# Altium schematic sheet TD.0002-100_2.SchDoc: ДТТ-1
size 420 x 297 mm; ApprovedBy: Маханов; CheckedBy: Айкеева; Organization: РЭТ-41; SheetNumber: 2; SheetTotal: 3; ProcessInspection: Айкеева; NormInspection: Мухамедрахимова
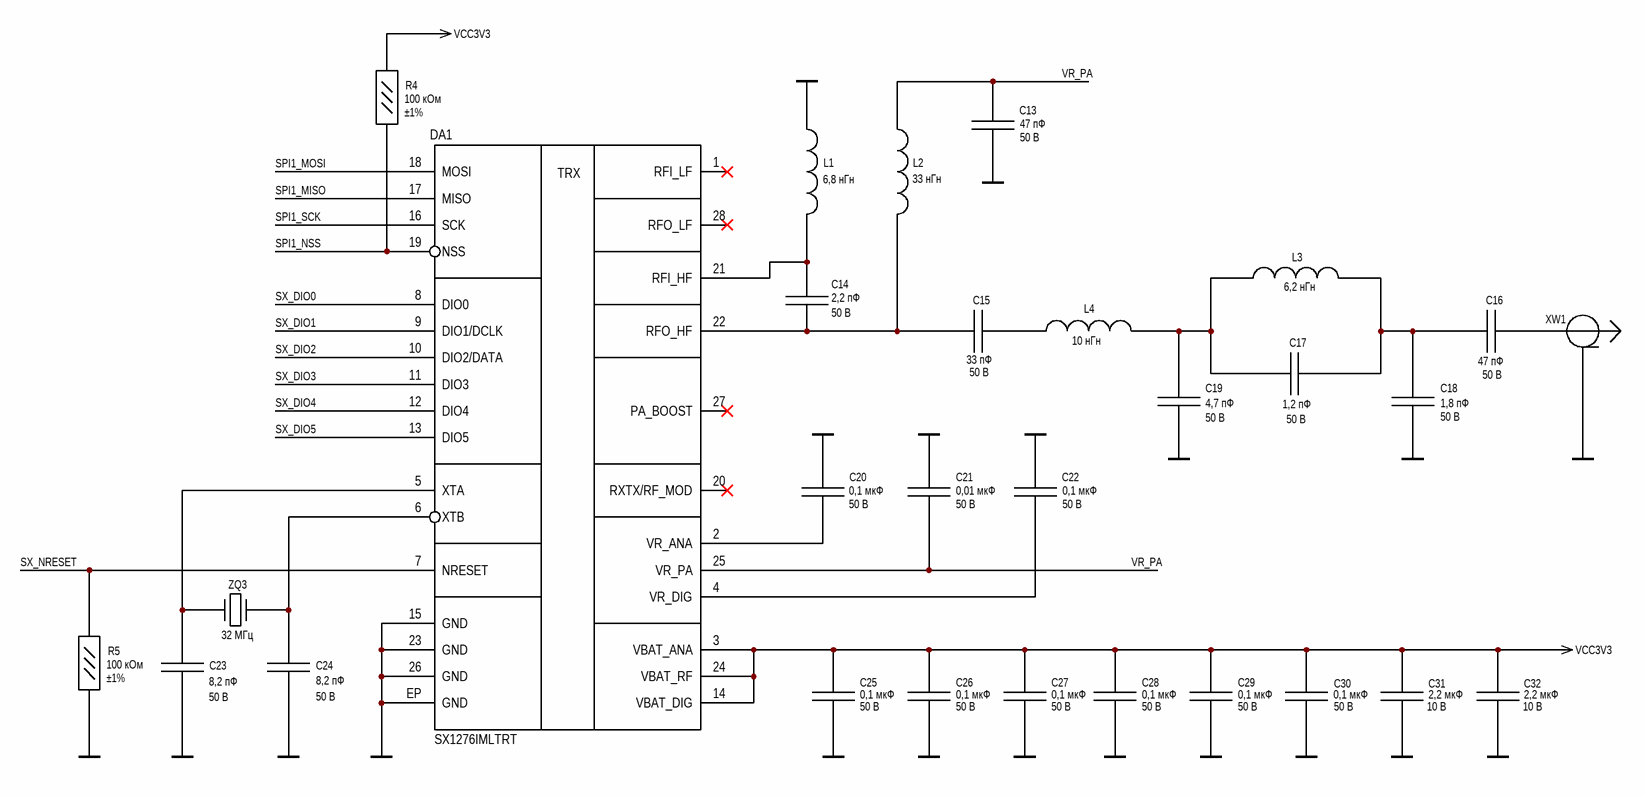
[diagram p0: TD.0002-100_2.SchDoc]

## Parts
C13  value 47 пФ  Voltage: 50 В  [C_0402]  (hidden comment: GRM1555C1H470GA01)
C14  value 2,2 пФ  Voltage: 50 В  [C_0402]  (hidden comment: GRM1555C1H2R2CA01)
C15  value 33 пФ  Voltage: 50 В  [C_0402]  (hidden comment: GRM1555C1H330GA01)
C16  value 47 пФ  Voltage: 50 В  [C_0402]  (hidden comment: GRM1555C1H470GA01)
C17  value 1,2 пФ  Voltage: 50 В  [C_0402]  (hidden comment: GRM1555C1H1R2CA01)
C18  value 1,8 пФ  Voltage: 50 В  [C_0402]  (hidden comment: GRM1555C1H1R8CA01)
C19  value 4,7 пФ  Voltage: 50 В  [C_0402]  (hidden comment: GRM1555C1H4R7CA01)
C20  value 0,1 мкФ  Voltage: 50 В  [C_0402]  (hidden comment: GRM155R71H104KE14)
C21  value 0,01 мкФ  Voltage: 50 В  [C_0402]  (hidden comment: GRM155R71H103KA88)
C22  value 0,1 мкФ  Voltage: 50 В  [C_0402]  (hidden comment: GRM155R71H104KE14)
C23  value 8,2 пФ  Voltage: 50 В  [C_0402]  (hidden comment: GRM1555C1H8R2WA01)
C24  value 8,2 пФ  Voltage: 50 В  [C_0402]  (hidden comment: GRM1555C1H8R2WA01)
C25  value 0,1 мкФ  Voltage: 50 В  [C_0402]  (hidden comment: GRM155R71H104KE14)
C26  value 0,1 мкФ  Voltage: 50 В  [C_0402]  (hidden comment: GRM155R71H104KE14)
C27  value 0,1 мкФ  Voltage: 50 В  [C_0402]  (hidden comment: GRM155R71H104KE14)
C28  value 0,1 мкФ  Voltage: 50 В  [C_0402]  (hidden comment: GRM155R71H104KE14)
C29  value 0,1 мкФ  Voltage: 50 В  [C_0402]  (hidden comment: GRM155R71H104KE14)
C30  value 0,1 мкФ  Voltage: 50 В  [C_0402]  (hidden comment: GRM155R71H104KE14)
C31  value 2,2 мкФ  Voltage: 10 В  [C_0402]  (hidden comment: GRM155C81A225ME44)
C32  value 2,2 мкФ  Voltage: 10 В  [C_0402]  (hidden comment: GRM155C81A225ME44)
DA1  SX1276IMLTRT  [QFN_28]
L1  value 6,8 нГн  [L_0402]  (hidden comment: LQW15AN6N8G80)
L2  value 33 нГн  [L_0402]  (hidden comment: LQW15AN33NJ00)
L3  value 6,2 нГн  [L_0402]  (hidden comment: LQW15AN6N2G8Z)
L4  value 10 нГн  [L_0402]  (hidden comment: LQW15AN10NG80)
R4  value 100 кОм  Accuracy: ±1%  [R_0402]  (hidden comment: RC0402FR-07100KL)
R5  value 100 кОм  Accuracy: ±1%  [R_0402]  (hidden comment: RC0402FR-07100KL)
XW1  U.FL-R-SMT  [U.FL-R-SMT]  (value not drawn)
ZQ3  value 32 МГц  [CM9V-T1A]  (hidden comment: Quartz)

## Nets
GND: C13.2 C18.2 C19.2 C20.1 C21.1 C22.1 C23.2 C24.2 C25.2 C26.2 C27.2 C28.2 C29.2 C30.2 C31.2 C32.2 DA1.15(GND) DA1.23(GND) DA1.26(GND) DA1.EP(GND) L1.1 R5.1 XW1.2(GND)
VCC3V3: C25.1 C26.1 C27.1 C28.1 C29.1 C30.1 C31.1 C32.1 DA1.3(VBAT_ANA) DA1.14(VBAT_DIG) DA1.24(VBAT_RF) R4.2
SPI1_MISO: DA1.17(MISO)
SPI1_MOSI: DA1.18(MOSI)
SPI1_NSS: DA1.19(NSS) R4.1
SPI1_SCK: DA1.16(SCK)
SX_DIO0: DA1.8(DIO0)
SX_DIO1: DA1.9(DIO1/DCLK)
SX_DIO2: DA1.10(DIO2/DATA)
SX_DIO3: DA1.11(DIO3)
SX_DIO4: DA1.12(DIO4)
SX_DIO5: DA1.13(DIO5)
SX_NRESET: DA1.7(NRESET) R5.2
VR_PA: C13.1 C21.2 DA1.25(VR_PA) L2.1
NetC14_1: C14.1 DA1.21(RFI_HF) L1.2
NetC14_2: C14.2 C15.1 DA1.22(RFO_HF) L2.2
NetC15_2: C15.2 L4.1
NetC16_1: C16.1 C17.2 C18.1 L3.2
NetC16_2: C16.2 XW1.1(SIGNAL)
NetC17_1: C17.1 C19.1 L3.1 L4.2
NetC20_2: C20.2 DA1.2(VR_ANA)
NetC22_2: C22.2 DA1.4(VR_DIG)
NetC23_1: C23.1 DA1.5(XTA) ZQ3.1(XI)
NetC24_1: C24.1 DA1.6(XTB) ZQ3.2(XO)

Not connected (* = marked no-connect by the designer): DA1 1(RFI_LF)* 20(RXTX/RF_MOD)* 27(PA_BOOST)* 28(RFO_LF)*

## Notes on the sheet
- Перв. примен.
- Справ. №
- Подп. и дата
- Инв. № дубл.
- Взам. инв. №
- Изм.
- Лист
- № докум.
- Подп.
- Дата
- Лит.
- Масса
- Масштаб
- Т.контр.
- Пров.
- Разраб.
- Листов
- Инв. № подл.
- Н.контр.
- Утв.
- Копировал
- Формат А3
- (in symbol SX1276IMLTRT) TRX

## Library data of the parts
C13 C16 = GRM1555C1H470GA01: Chip Multilayer Ceramic Capacitor; Manufacturer: Murata; TC: C0G; Tolerance: ±2%; Type: Конденсатор керамический; Operating temperature: -55 … 125 °C; Part Number: GRM1555C1H470GA01; Library Ref: *; Library Path: *; Package: SMD 0402; Temperature coefficient: *
C14 = GRM1555C1H2R2CA01: Chip Multilayer Ceramic Capacitor; Manufacturer: Murata; TC: C0G; Tolerance: ±0,25 пФ; Type: Конденсатор керамический; Operating temperature: -55 … 125 °C; Part Number: GRM1555C1H2R2CA01; Library Ref: *; Library Path: *; Package: SMD 0402; Temperature coefficient: *
C15 = GRM1555C1H330GA01: Chip Multilayer Ceramic Capacitor; Manufacturer: Murata; TC: C0G; Tolerance: ±2%; Type: Конденсатор керамический; Operating temperature: -55 … 125 °C; Part Number: GRM1555C1H330GA01; Library Ref: *; Library Path: *; Package: SMD 0402; Temperature coefficient: *
C17 = GRM1555C1H1R2CA01: Chip Multilayer Ceramic Capacitor; Manufacturer: Murata; TC: C0G; Tolerance: ±0,25 пФ; Type: Конденсатор керамический; Operating temperature: -55 … 125 °C; Part Number: GRM1555C1H1R2CA01; Library Ref: *; Library Path: *; Package: SMD 0402; Temperature coefficient: *
C18 = GRM1555C1H1R8CA01: Chip Multilayer Ceramic Capacitor; Manufacturer: Murata; TC: C0G; Tolerance: ±0,25 пФ; Type: Конденсатор керамический; Operating temperature: -55 … 125 °C; Part Number: GRM1555C1H1R8CA01; Library Ref: *; Library Path: *; Package: SMD 0402; Temperature coefficient: *
C19 = GRM1555C1H4R7CA01: Chip Multilayer Ceramic Capacitor; Manufacturer: Murata; TC: C0G; Tolerance: ±0,25 пФ; Type: Конденсатор керамический; Operating temperature: -55 … 125 °C; Part Number: GRM1555C1H4R7CA01; Library Ref: *; Library Path: *; Package: SMD 0402; Temperature coefficient: *
C20 C22 C25-C30 = GRM155R71H104KE14: Chip Multilayer Ceramic Capacitor; Manufacturer: Murata; TC: X7R; Tolerance: ±10%; Type: Конденсатор керамический; Operating temperature: -55 … 125 °C; Part Number: GRM155R71H104KE14; Library Ref: *; Library Path: *; Package: SMD 0402; Temperature coefficient: *
C21 = GRM155R71H103KA88: Chip Multilayer Ceramic Capacitor; Manufacturer: Murata; TC: X7R; Tolerance: ±10%; Type: Конденсатор керамический; Operating temperature: -55 … 125 °C; Part Number: GRM155R71H103KA88; Library Ref: *; Library Path: *; Package: SMD 0402; Temperature coefficient: *
C23 C24 = GRM1555C1H8R2WA01: Chip Multilayer Ceramic Capacitor; Manufacturer: Murata; TC: C0G; Tolerance: ±0,05 пФ; Type: Конденсатор керамический; Operating temperature: -55 … 125 °C; Part Number: GRM1555C1H8R2WA01; Library Ref: *; Library Path: *; Package: SMD 0402; Temperature coefficient: *
C31 C32 = GRM155C81A225ME44: Chip Multilayer Ceramic Capacitor; Manufacturer: Murata; TC: X6S; Tolerance: ±20%; Type: Конденсатор керамический; Operating temperature: -55 … 105 °C; Part Number: GRM155C81A225ME44; Library Ref: *; Library Path: *; Package: SMD 0402; Temperature coefficient: *
DA1 = SX1276IMLTRT: 860 MHz to 1020 MHz Low Power Long Range Transceiver; Manufacturer: Semtech; Supply voltage: 1,8 ... 3,7 В; Interface: SPI; Baudrate: 1,7 ... 300 кбит/с; Modulation: GFSK/FSK/GMSK/MSK/OOK/LoRa; Frequency range: 137 ... 1020 MHz; Type: Transceiver RF; Temperature range: -40 ... +85 °C
L1 = LQW15AN6N8G80: Manufacturer: Murata; Current: 1450 мА; Tolerance: ±2%; Type: Катушки постоянной индуктивности; Part Number: LQW15AN6N8G80; Package: SMD 0402; Operating temperature: -55 … 125 °C; Library Ref: *; Footprint Ref: *; Library Path: *; Footprint Path: *
L2 = LQW15AN33NJ00: Manufacturer: Murata; Current: 260 мА; Tolerance: ±5%; Type: Катушки постоянной индуктивности; Part Number: LQW15AN33NJ00; Package: SMD 0402; Operating temperature: -55 … 125 °C; Library Ref: *; Footprint Ref: *; Library Path: *; Footprint Path: *
L3 = LQW15AN6N2G8Z: Manufacturer: Murata; Current: 1600 мА; Tolerance: ±2%; Type: Катушки постоянной индуктивности; Part Number: LQW15AN6N2G8Z; Package: SMD 0402; Operating temperature: -55 … 125 °C; Library Ref: *; Footprint Ref: *; Library Path: *; Footprint Path: *
L4 = LQW15AN10NG80: Manufacturer: Murata; Current: 1400 мА; Tolerance: ±2%; Type: Катушки постоянной индуктивности; Part Number: LQW15AN10NG80; Package: SMD 0402; Operating temperature: -55 … 125 °C; Library Ref: *; Footprint Ref: *; Library Path: *; Footprint Path: *
R4 R5 = RC0402FR-07100KL: High Reliability; Manufacturer: Yageo; Voltage: 50 В; Power dissipation: *; Part Number: RC0402FR-07100KL; Package: SMD 0402; Operating temperature: -55 … 155 °C; Type: Толстопленочный
XW1 = U.FL-R-SMT: Manufacturer: Hirose Electric; Maximum frequency: 6 GHz; Wave resistance: 50 Ohm; Type: Connector; Operating temperature range: -40 ... +90 ºC